# EAGLE design MurataBreakout_rev1 (EAGLE 9.0.1)
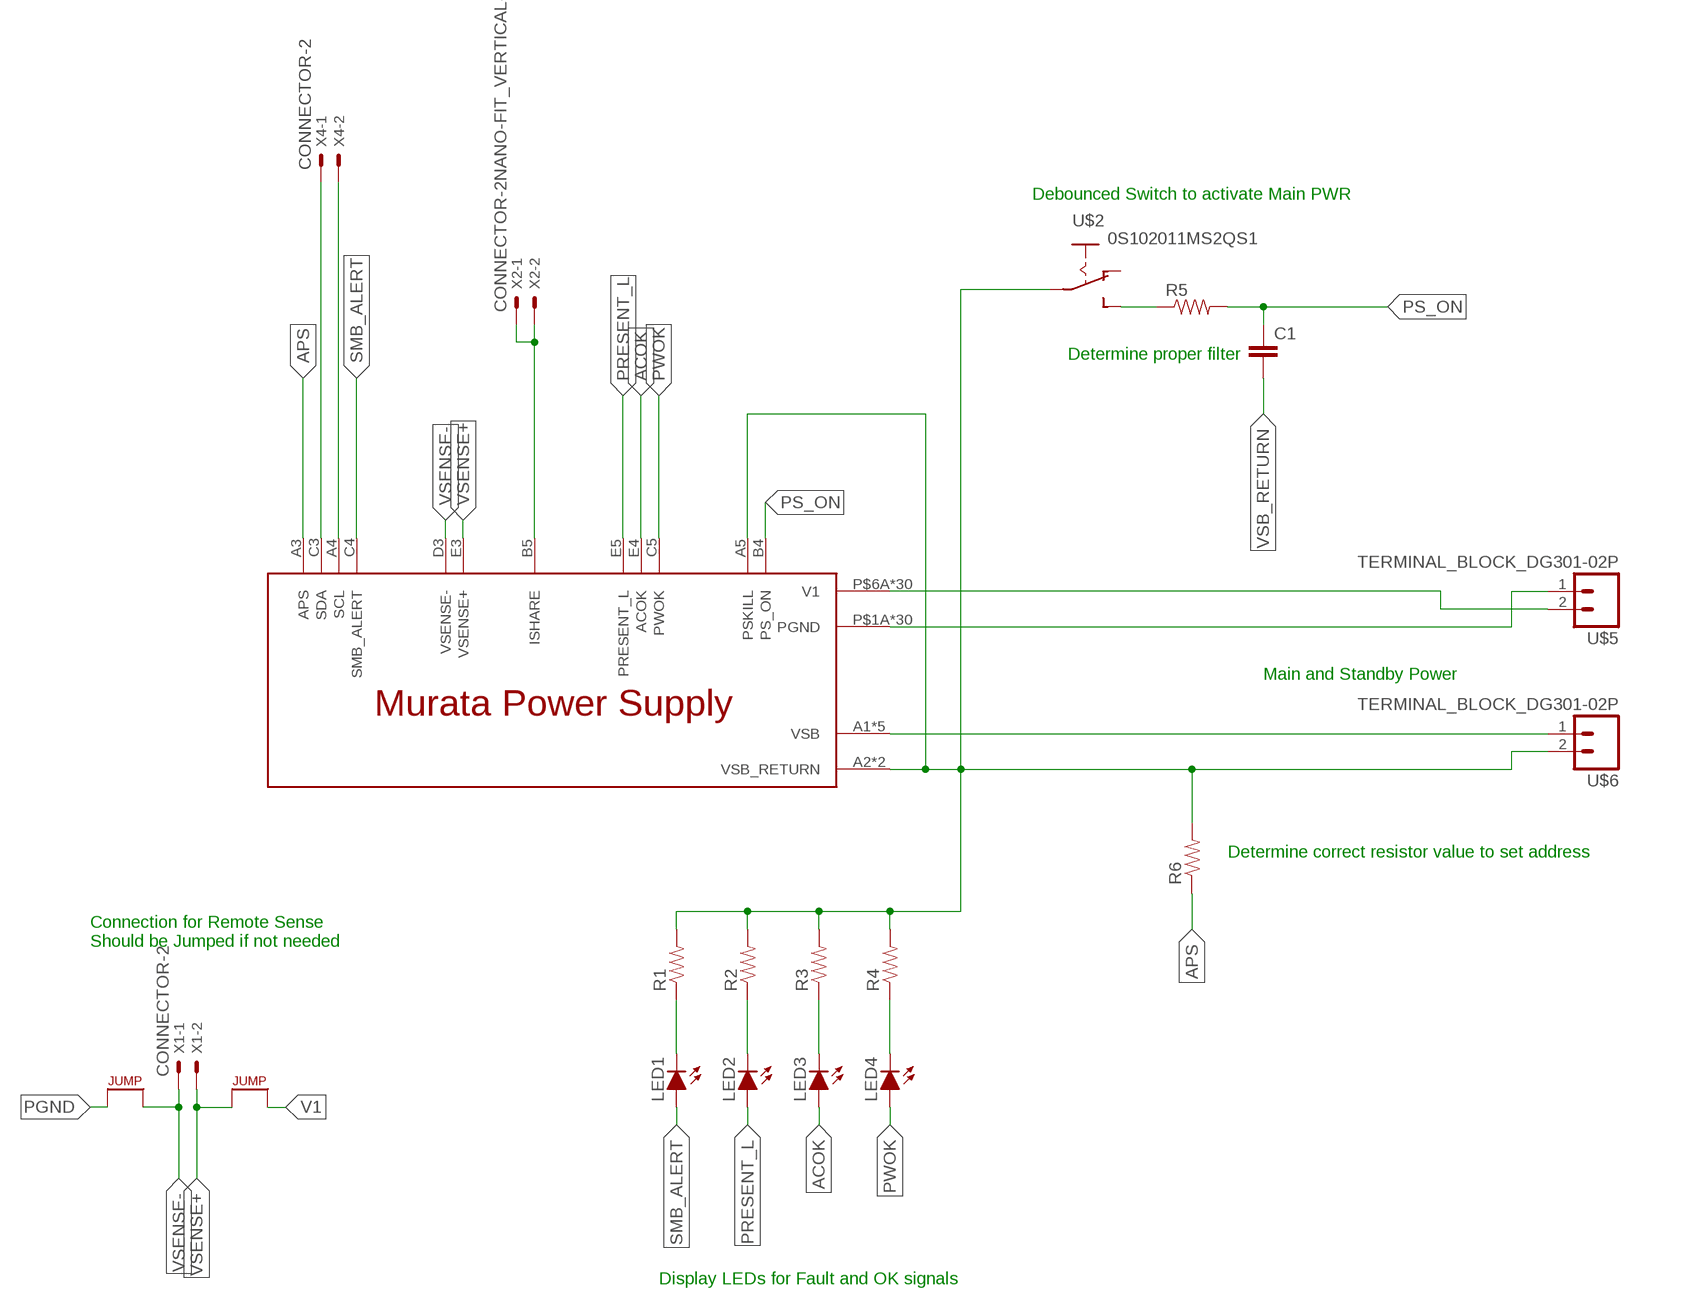
[diagram p0: schematic, sheet 1]

## Parts
C1  CAP0805  [0805]
LED1  LED-0805  [LED-805]
LED2  LED-0805  [LED-805]
LED3  LED-0805  [LED-805]
LED4  LED-0805  [LED-805]
R1  RESISTOR0805-RES  [0805]
R2  RESISTOR0805-RES  [0805]
R3  RESISTOR0805-RES  [0805]
R4  RESISTOR0805-RES  [0805]
R5  RESISTOR0805-RES  [0805]
R6  RESISTOR0805-RES  [0805]
U$1  MURATA_POWER_SUPPLY  [MURATA_POWER_SUPPLY_CONNECTOR]
U$2  0S102011MS2QS1  [0S102011MS2QS1]
U$3  JUMPER.1  [1X02]
U$4  JUMPER.1  [1X02]
U$5  TERMINAL_BLOCK_DG301-02P  [DG301-02P]
U$6  TERMINAL_BLOCK_DG301-02P  [DG301-02P]
X1  CONNECTOR-2  [MINIFIT_5566-2]
X2  CONNECTOR-2NANO-FIT_VERTICAL-2  [NANO-FIT_VERTICAL-2]
X4  CONNECTOR-2  [MINIFIT_5566-2]

## Nets
ACOK: LED3.A U$1.E4(ACOK)
APS: R6.1 U$1.A3(APS)
N$1: LED4.C R4.1
N$2: LED3.C R3.1
N$3: LED2.C R2.1
N$4: LED1.C R1.1
N$5: U$1.B5(ISHARE) X2.P$1 X2.P$2
N$6: R5.1 U$2.P$3(S)
PGND: U$1.P$1A(PGND) U$1.P$1B(PGND) U$1.P$1C(PGND) U$1.P$1D(PGND) U$1.P$1E(PGND) U$1.P$1F(PGND) U$1.P$2A(PGND) U$1.P$2B(PGND) U$1.P$2C(PGND) U$1.P$2D(PGND) U$1.P$2E(PGND) U$1.P$2F(PGND) U$1.P$3A(PGND) U$1.P$3B(PGND) U$1.P$3C(PGND) U$1.P$3D(PGND) U$1.P$3E(PGND) U$1.P$3F(PGND) U$1.P$4A(PGND) U$1.P$4B(PGND) U$1.P$4C(PGND) U$1.P$4D(PGND) U$1.P$4E(PGND) U$1.P$4F(PGND) U$1.P$5A(PGND) U$1.P$5B(PGND) U$1.P$5C(PGND) U$1.P$5D(PGND) U$1.P$5E(PGND) U$1.P$5F(PGND) U$4.1 U$5.1
PRESENT_L: LED2.A U$1.E5(PRESENT_L)
PS_ON: C1.1 R5.2 U$1.B4(PS_ON)
PWOK: LED4.A U$1.C5(PWOK)
SCL: U$1.A4(SCL) X4.2
SDA: U$1.C3(SDA) X4.1
SMB_ALERT: LED1.A U$1.C4(SMB_ALERT)
V1: U$1.P$6A(V1) U$1.P$6B(V1) U$1.P$6C(V1) U$1.P$6D(V1) U$1.P$6E(V1) U$1.P$6F(V1) U$1.P$7A(V1) U$1.P$7B(V1) U$1.P$7C(V1) U$1.P$7D(V1) U$1.P$7E(V1) U$1.P$7F(V1) U$1.P$8A(V1) U$1.P$8B(V1) U$1.P$8C(V1) U$1.P$8D(V1) U$1.P$8E(V1) U$1.P$8F(V1) U$1.P$9A(V1) U$1.P$9B(V1) U$1.P$9C(V1) U$1.P$9D(V1) U$1.P$9E(V1) U$1.P$9F(V1) U$1.P$10A(V1) U$1.P$10B(V1) U$1.P$10C(V1) U$1.P$10D(V1) U$1.P$10E(V1) U$1.P$10F(V1) U$3.2 U$5.2
VSB: U$1.A1(VSB) U$1.B1(VSB) U$1.C1(VSB) U$1.D1(VSB) U$1.E1(VSB) U$6.1
VSB_RETURN: C1.2 R1.2 R2.2 R3.2 R4.2 R6.2 U$1.A2(VSB_RETURN) U$1.A5(PSKILL) U$1.B2(VSB_RETURN) U$2.P$2(P) U$6.2
VSENSE+: U$1.E3(VSENSE+) U$3.1 X1.2
VSENSE-: U$1.D3(VSENSE-) U$4.2 X1.1
Unconnected: U$2.P$1(O)

## Notes on the sheet
- Debounced Switch to activate Main PWR
- Determine proper filter
- Main and Standby Power
- Determine correct resistor value to set address
- Connection for Remote Sense
  Should be Jumped if not needed
- Display LEDs for Fault and OK signals

## Library data of the parts
C1 = HyTechDevices:CAP: Capacitor Standard 0603 ceramic capacitor, and 0.1" leaded capacitor.
LED1-LED4 = HyTechDevices:LED: Light Emitting Diode (LED) Source: Dangerous Prototypes Eagle Library <https://github.com/DangerousPrototypes/Eagle_Part_Library>
R1-R6 = HyTechDevices:RESISTOR: Resistor Basic schematic elements and footprints for 0603, 1206, and PTH resistors.
U$1 = HyTechDevices:MURATA_POWER_SUPPLY
U$2 = HyTechDevices:0S102011MS2QS1: Slide Switch 0S102011MS2QS1
U$3 U$4 = HyTechDevices:JUMPER: Jumper for changing operation of a device
U$5 U$6 = HyTechDevices:TERMINAL_BLOCK_DG301-02P: DG301-02P Terminal block Tayda Electronics Store <http://www.taydaelectronics.com/connectors-sockets/terminal-blocks/dg301-screw-terminal-block-2-positions-5mm.html> Datasheet <http://www.tme.eu/en/Document/72ad9f371bb0c16572574ac47903b3a1/DG301-5.0.pdf> Specs: Positions: 2 Pitch: 5.00mm Wire: 12-24 AWG Max Current: 15A Max Voltage: 300V
X1 X4 = HyTechDevices:CONNECTOR-2: Mini-Fit Junior connector 2 pole Source: http://www.molex.com; OC_FARNELL: 1822072; OC_NEWARK: unknown
X2 = HyTechDevices:CONNECTOR-2: Mini-Fit Junior connector 2 pole Source: http://www.molex.com

## Board
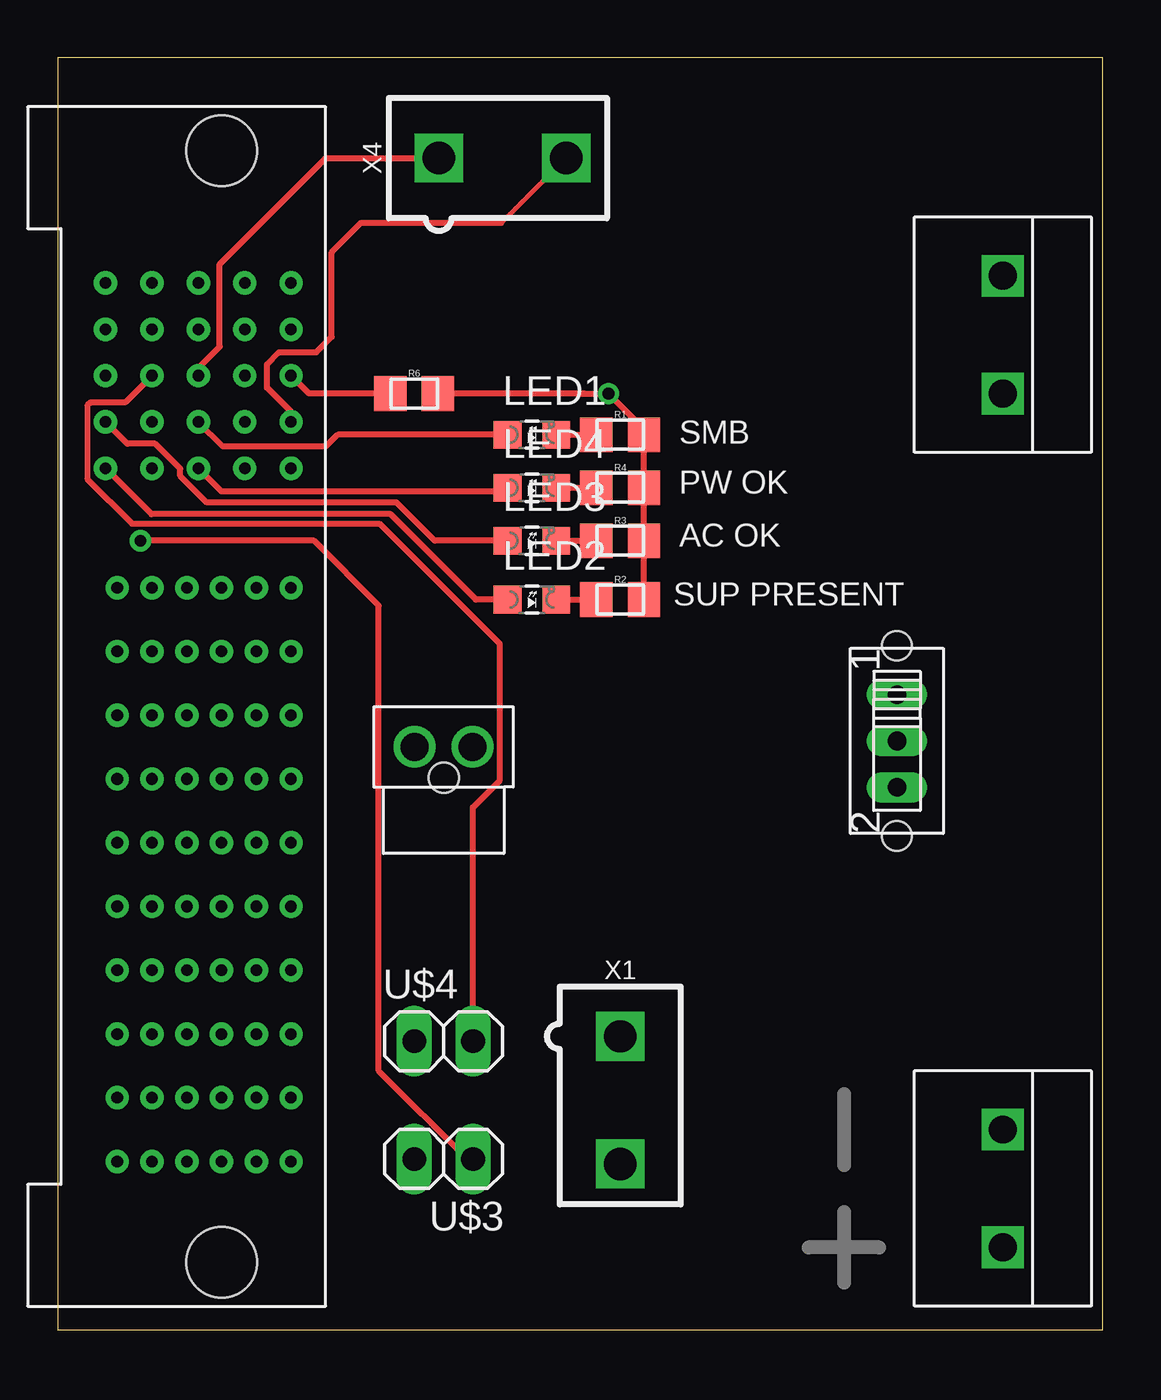
[diagram p1: board, top side]
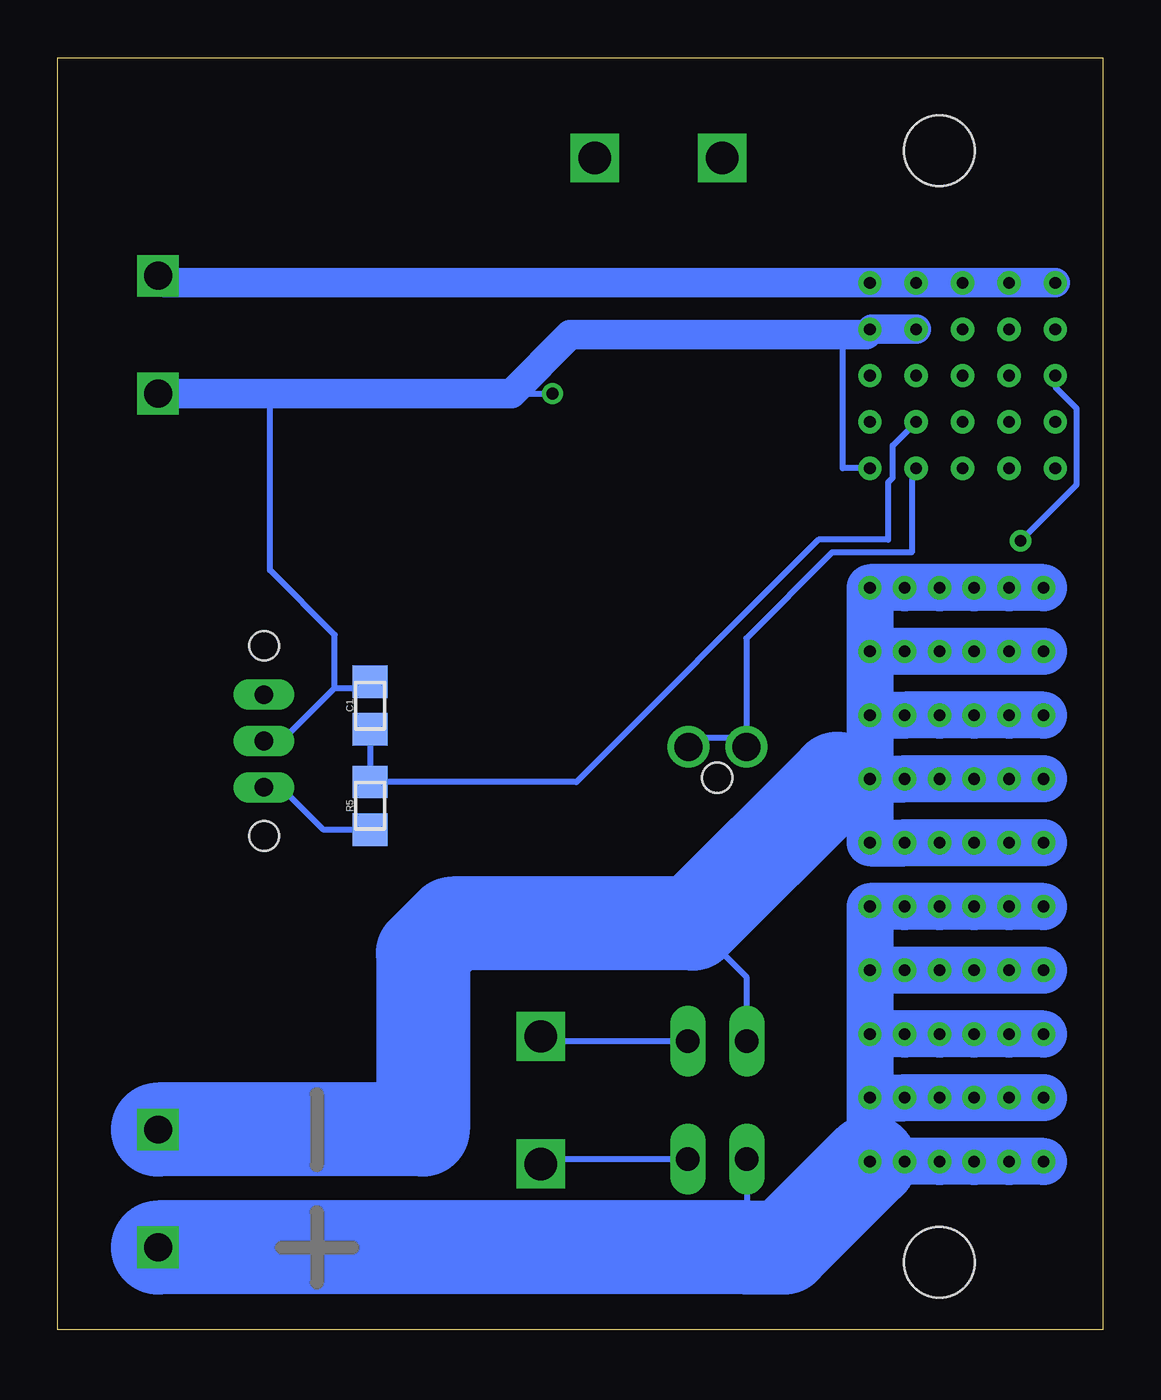
[diagram p2: board, bottom side, seen from below]

Size 45.08 x 54.86 mm. Coordinates in mm from the lower left corner, seen from the top.
Outline: 0,0 45.08,0 45.08,54.86 0,54.86 0,0
Copper layers (1*16): Top 0.035mm / dielectric 1.5mm / Bottom 0.035mm
Design rules "DRC Advanced Circuits": minimum track width 6mil, minimum drill 15mil, track to track 6mil, track to pad 6mil, pad to pad 6mil, via to via 6mil, smd to smd 6mil, copper to edge 40mil, drill to drill 6mil, minimum pad ring 10mil, minimum via ring 8mil, stop-mask expansion 4mil, vias tented up to drill 0mil, thermal gap 10mil

### Footprints (pad centres in the part's own frame; a part is rotated, then mirrored left to right if it is on the bottom)
0805 = smd 1.4 x 1.5: 1 -1.025,0; 2 1.025,0
LED-805 = smd 1.2 x 1.2: A 0,-1.05; C 0,1.05
MURATA_POWER_SUPPLY_CONNECTOR = drill 0.5: A1 44.145,1.5; A2 42.145,1.5; A3 40.145,1.5; A4 38.145,1.5; A5 36.145,1.5; B1 44.145,3.5; B2 42.145,3.5; B3 40.145,3.5; B4 38.145,3.5; B5 36.145,3.5; C1 44.145,5.5; C2 42.145,5.5; C3 40.145,5.5; C4 38.145,5.5; C5 36.145,5.5; D1 44.145,7.5; D2 42.145,7.5; D3 40.145,7.5; D4 38.145,7.5; D5 36.145,7.5; E1 44.145,9.5; E2 42.145,9.5; E3 40.145,9.5; E4 38.145,9.5; E5 36.145,9.5; P$1A 30.995,9; P$1B 30.995,7.5; P$1C 30.995,6; P$1D 30.995,4.5; P$1E 30.995,3; P$1F 30.995,1.5; P$2A 28.245,9; P$2B 28.245,7.5; P$2C 28.245,6; P$2D 28.245,4.5; P$2E 28.245,3; P$2F 28.245,1.5; P$3A 25.495,9; P$3B 25.495,7.5; P$3C 25.495,6; P$3D 25.495,4.5; P$3E 25.495,3; P$3F 25.495,1.5; P$4A 22.745,9; P$4B 22.745,7.5; P$4C 22.745,6; P$4D 22.745,4.5; P$4E 22.745,3; P$4F 22.745,1.5; P$5A 19.995,9; P$5B 19.995,7.5; P$5C 19.995,6; P$5D 19.995,4.5; P$5E 19.995,3; P$5F 19.995,1.5; P$6A 17.245,9; P$6B 17.245,7.5; P$6C 17.245,6; P$6D 17.245,4.5; P$6E 17.245,3; P$6F 17.245,1.5; P$7A 14.495,9; P$7B 14.495,7.5; P$7C 14.495,6; P$7D 14.495,4.5; P$7E 14.495,3; P$7F 14.495,1.5; P$8A 11.745,9; P$8B 11.745,7.5; P$8C 11.745,6; P$8D 11.745,4.5; P$8E 11.745,3; P$8F 11.745,1.5; P$9A 8.995,9; P$9B 8.995,7.5; P$9C 8.995,6; P$9D 8.995,4.5; P$9E 8.995,3; P$9F 8.995,1.5; P$10A 6.245,9; P$10B 6.245,7.5; P$10C 6.245,6; P$10D 6.245,4.5; P$10E 6.245,3; P$10F 6.245,1.5 | hole 3.05: 1.9,4.5; 49.84,4.5
0S102011MS2QS1 = drill 0.8 long: P$1 -2,0; P$2 0,0; P$3 2,0 | hole 1.27: 4.102,0; -4.102,0
1X02 = drill 1.016 long: 1 -1.27,0; 2 1.27,0
DG301-02P = drill 1.2 square: 1 2.54,3.81; 2 7.62,3.81
MINIFIT_5566-2 = drill 1.4 square: 1 0,-2.75; 2 0,2.75
NANO-FIT_VERTICAL-2 = drill 1.2: P$1 -1.25,0; P$2 1.25,0 | hole 1.3: 0,-1.34

### Placement (x,y rotation side)
C1  31.62,26.92 90 bottom
LED1  20.45,38.61 270 top
LED2  20.45,31.5 270 top
LED3  20.45,34.04 270 top
LED4  20.45,36.32 270 top
R1  24.26,38.61 0 top
R2  24.26,31.5 0 top
R3  24.26,34.04 0 top
R4  24.26,36.32 0 top
R5  31.62,22.61 90 bottom
R6  15.37,40.39 0 top
U$1  11.56,1.02 90 top
U$2  36.19,25.4 270 top
U$3  16.64,7.37 180 top
U$4  16.64,12.45 0 top
U$5  36.96,11.18 270 top
U$6  36.96,48.01 270 top
X1  24.26,9.91 180 top
X2  16.64,25.15 0 top
X4  19.18,50.55 270 top

### Tracks (layer width: path | path; a pad name or v marks a point on that pad's centre or on a via)
ACOK
  Top 0.254: LED3.A 16.26,34.04 14.61,35.69 6.42,35.69 5.27,36.84 5.27,37.14 4.19,38.23 2.99,38.23 U$1.E4
APS
  Top 0.254: R6.1 10.83,40.39 U$1.A3
N$1
  Top 0.254: LED4.C R4.1
N$2
  Top 0.254: LED3.C R3.1
N$3
  Top 0.254: LED2.C R2.1
N$4
  Top 0.254: LED1.C R1.1
N$5
  Bottom 0.152: X2.P$2 17.76,25.15 | 15.51,25.15 X2.P$1 | 15.39,29.83 | U$1.B5 8.26,36.96
  Bottom 0.254: 17.76,25.15 17.36,25.55 15.91,25.55 15.51,25.15 | X2.P$1 15.39,29.83 11.69,33.53 8.26,33.53 8.26,36.96
N$6
  Bottom 0.152: 31.63,21.59 R5.1
  Bottom 0.254: U$2.P$3 35.46,23.4 33.65,21.59 31.63,21.59
PGND
  Bottom 0.152: U$1.P$4F 10.01,23.76 10.06,23.81 | 10.06,26.6 9.97,26.51 U$1.P$3F 10.06,26.33 10.15,26.42 | 10.06,21.03 10.04,21.01 U$1.P$5F 10.61,21.01
  Bottom 0.254: U$4.1 15.37,15.19 17.7,17.53
  Bottom 2.032: U$1.P$5A U$1.P$5B U$1.P$5C U$1.P$5D U$1.P$5E 10.04,21.01 | U$1.P$4A U$1.P$4B U$1.P$4C U$1.P$4D U$1.P$4E 10.01,23.76 | U$1.P$3A U$1.P$3B U$1.P$3C U$1.P$3D U$1.P$3E 9.97,26.51 | U$1.P$2A U$1.P$2B U$1.P$2C U$1.P$2D U$1.P$2E U$1.P$2F | U$1.P$1A U$1.P$1B U$1.P$1C U$1.P$1D U$1.P$1E U$1.P$1F U$1.P$2F | U$1.P$2F 10.06,26.6 | 10.06,26.33 10.06,23.81 | 10.06,21.03 U$1.P$4F 11.47,23.76
  Bottom 4.064: U$5.1 29.34,8.64 29.34,16.26 28.07,17.53 17.7,17.53 11.47,23.76
PRESENT_L
  Top 0.254: LED2.A 18.03,31.5 14.35,35.18 4.04,35.18 U$1.E5
PS_ON
  Bottom 0.254: C1.1 R5.2 22.72,23.63 12.27,34.09 9.27,34.09 9.27,36.55 9.07,36.75 9.07,38.15 U$1.B4
PWOK
  Top 0.152: 19.25,36.17 LED4.A
  Top 0.254: U$1.C5 7.04,36.17 19.25,36.17
SCL
  Top 0.203: 19.13,47.75 X4.2
  Top 0.254: 19.13,47.75 13.08,47.75 11.81,46.48 11.81,42.83 11.14,42.16 9.53,42.16 9.02,41.66 9.02,40.64 10.06,39.6 U$1.A4
SDA
  Top 0.254: X4.1 11.56,50.55 6.98,45.97 6.98,42.42 6.06,41.49 U$1.C3
SMB_ALERT
  Top 0.152: 19.22,38.43 LED1.A
  Top 0.254: LED1.A 12.06,38.61 11.56,38.1 7.12,38.1 U$1.C4
V1
  Bottom 0.152: U$1.P$10F 9.9,7.26 10.06,7.42 | U$1.P$9F 9.9,10.01 10.06,10.17 | 15.37,3.56 15.36,3.56
  Bottom 0.254: U$3.2 15.37,3.56
  Bottom 2.032: U$1.P$10A U$1.P$10B U$1.P$10C U$1.P$10D U$1.P$10E 9.9,7.26 | U$1.P$9A U$1.P$9B U$1.P$9C U$1.P$9D U$1.P$9E 9.9,10.01 | U$1.P$8A U$1.P$8B U$1.P$8C U$1.P$8D U$1.P$8E U$1.P$8F | U$1.P$7A U$1.P$7B U$1.P$7C U$1.P$7D U$1.P$7E U$1.P$7F | U$1.P$6A U$1.P$6B U$1.P$6C U$1.P$6D U$1.P$6E U$1.P$6F U$1.P$7F | U$1.P$7F U$1.P$8F | U$1.P$8F 10.06,10.17 | U$1.P$9F 10.06,7.42
  Bottom 4.064: U$5.2 15.36,3.56 13.76,3.56 U$1.P$10F
VSB
  Bottom 0.152: 40.46,45.16 U$6.1
  Bottom 1.27: U$1.E1 U$1.D1 U$1.C1 U$1.B1 U$1.A1 40.46,45.16
VSB_RETURN  (via drill 0.51)
  Top 0.254: R2.2 R3.2 R4.2 R1.2 25.28,38.85 v23.75,40.39 22.48,40.39 | 22.73,40.39 22.48,40.39 | 22.48,40.39 R6.2
  Bottom 0.152: 9.96,43.16 U$1.A2 | 31.89,27.69 C1.2 | 31.62,40.38 31.63,40.39 | 35.94,40.37 35.96,40.39 | 11.23,42.78 11.37,42.93
  Bottom 0.254: U$2.P$2 35.43,25.4 33.15,27.69 | 33.15,27.69 31.89,27.69 | U$1.A5 11.23,37.16 11.23,42.78 | 33.15,27.69 33.15,29.97 35.94,32.77 35.94,40.37 | 25.53,40.39 v23.75,40.39
  Bottom 0.406: 10.2,42.93 9.96,43.16
  Bottom 1.27: 9.96,43.16 U$1.B2 | U$6.2 35.96,40.39 31.63,40.39 25.53,40.39 22.99,42.93 11.37,42.93 10.2,42.93
VSENSE+  (via drill 0.51)
  Top 0.254: U$3.1 17.65,7.37 13.84,11.18 13.84,31.24 11.05,34.04 v3.56,34.04
  Bottom 0.254: U$3.1 24.05,7.37 X1.2 | 2.06,40.79 U$1.E3 2.06,40.66 1.14,39.75 1.14,36.45 v3.56,34.04
VSENSE-
  Top 0.254: U$4.2 17.91,22.54 19.07,23.7 19.07,29.57 13.87,34.77 3.2,34.77 1.27,36.7 1.27,39.88 1.4,40.01 2.9,40.01 U$1.D3
  Bottom 0.254: U$4.2 24.05,12.45 X1.1

### Text on the board
tPlace: SMB | PW OK | AC OK | SUP PRESENT
tDocu: Parker Jones